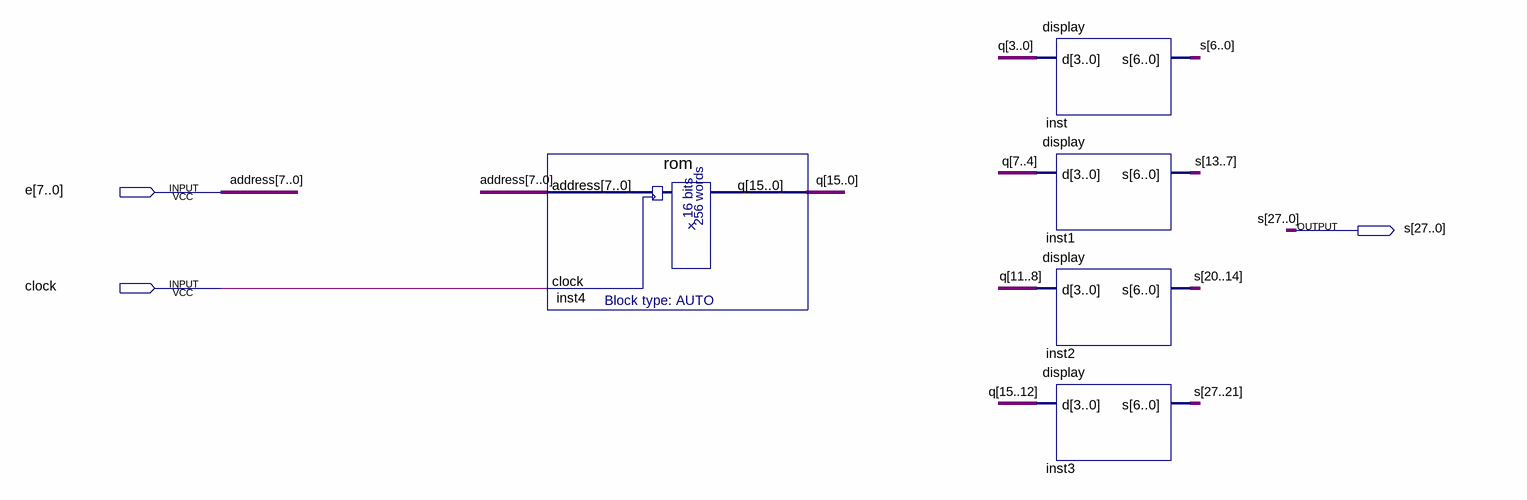
[diagram p0: schematic sheet]
// Quartus schematic memoria.bdf as structural Verilog: 5 symbols, 3 pins
module memoria (
  input  [7:0] e,
  input  clock,
  output [27:0] s
);

  wire [15:0] q;

  rom inst4 (.address(e), .clock(clock), .q(q));
  display inst (.d(q[3:0]), .s(s[6:0]));
  display inst1 (.d(q[7:4]), .s(s[13:7]));
  display inst2 (.d(q[11:8]), .s(s[20:14]));
  display inst3 (.d(q[15:12]), .s(s[27:21]));

  // Other names for the same wires on the sheet: address[7:0] = e
endmodule
